# EAGLE board framMega (EAGLE 8.3.0)
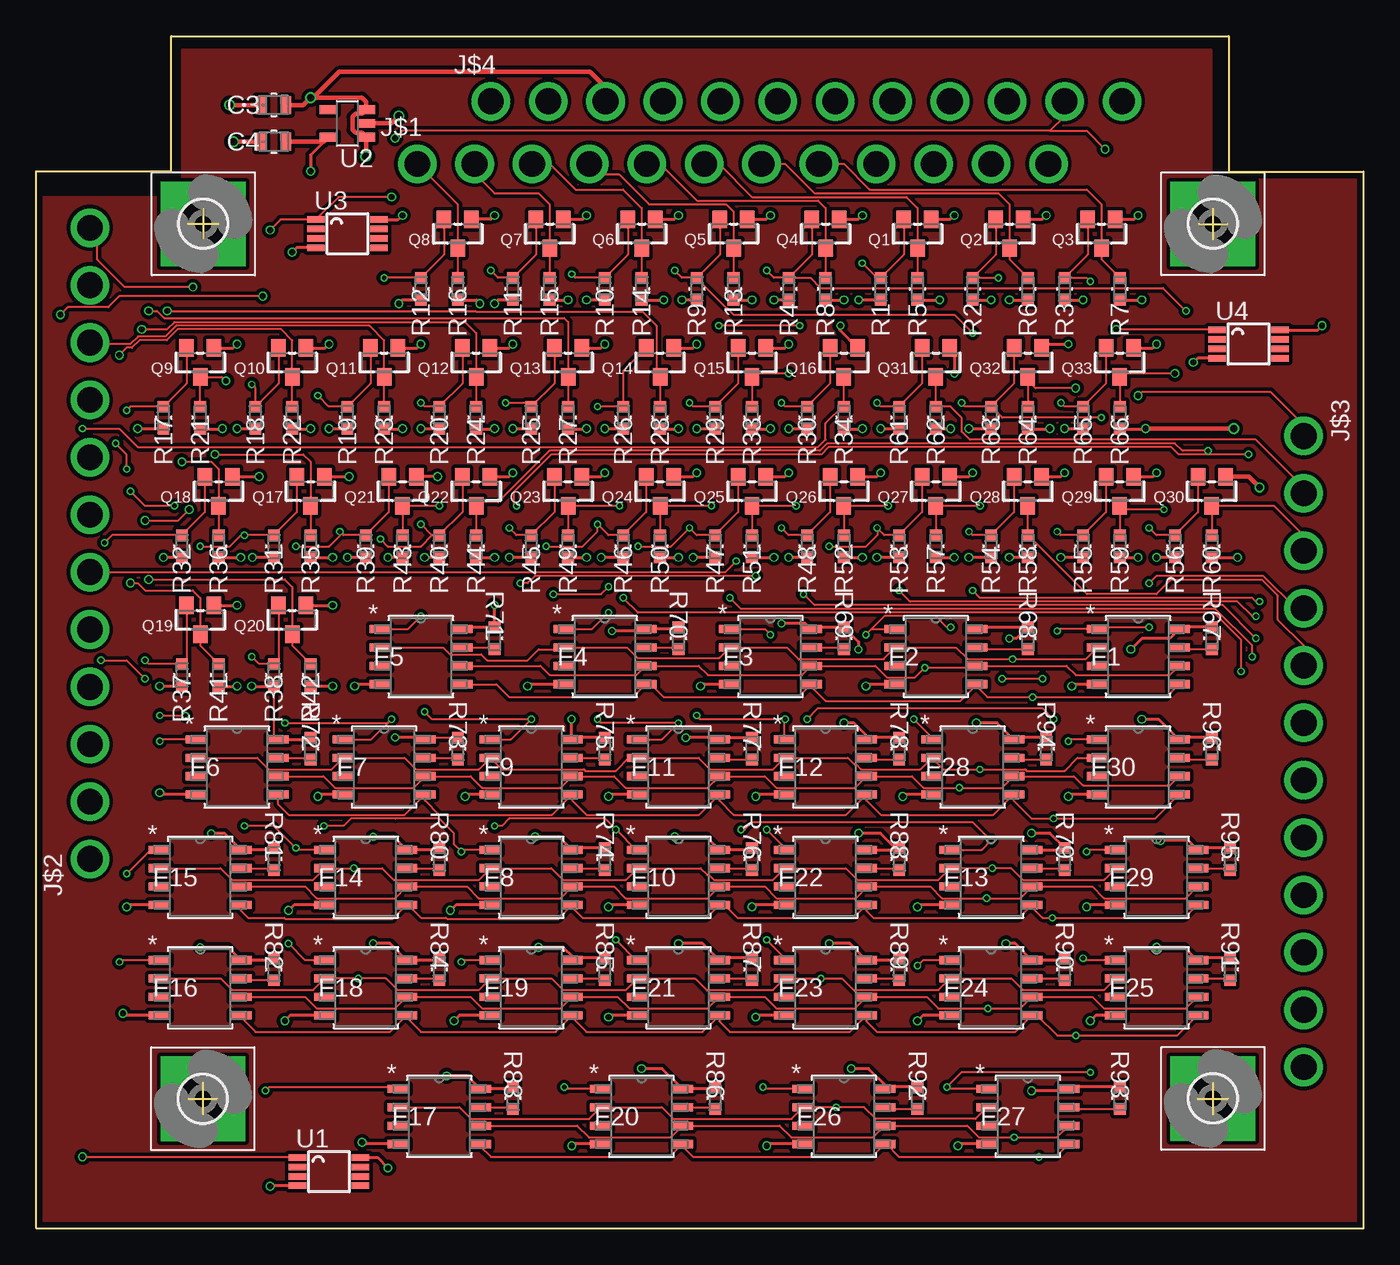
[diagram p9: board, top side]
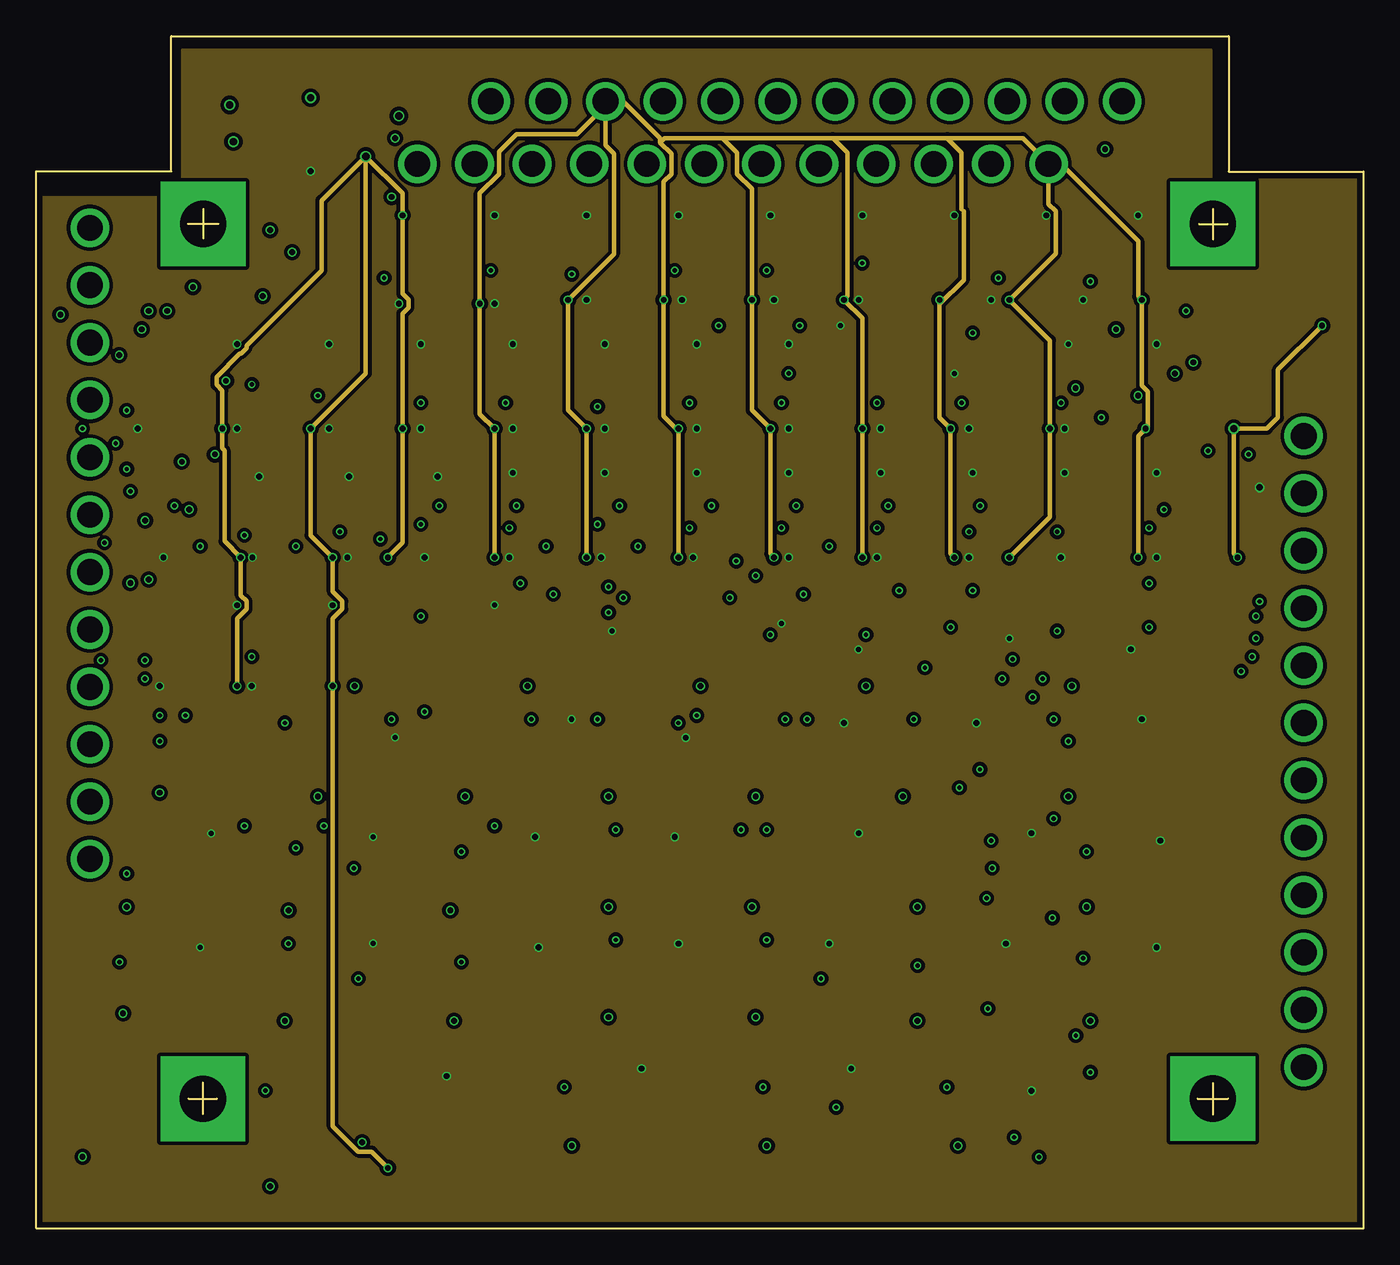
[diagram p10: board, inner layer Route2]
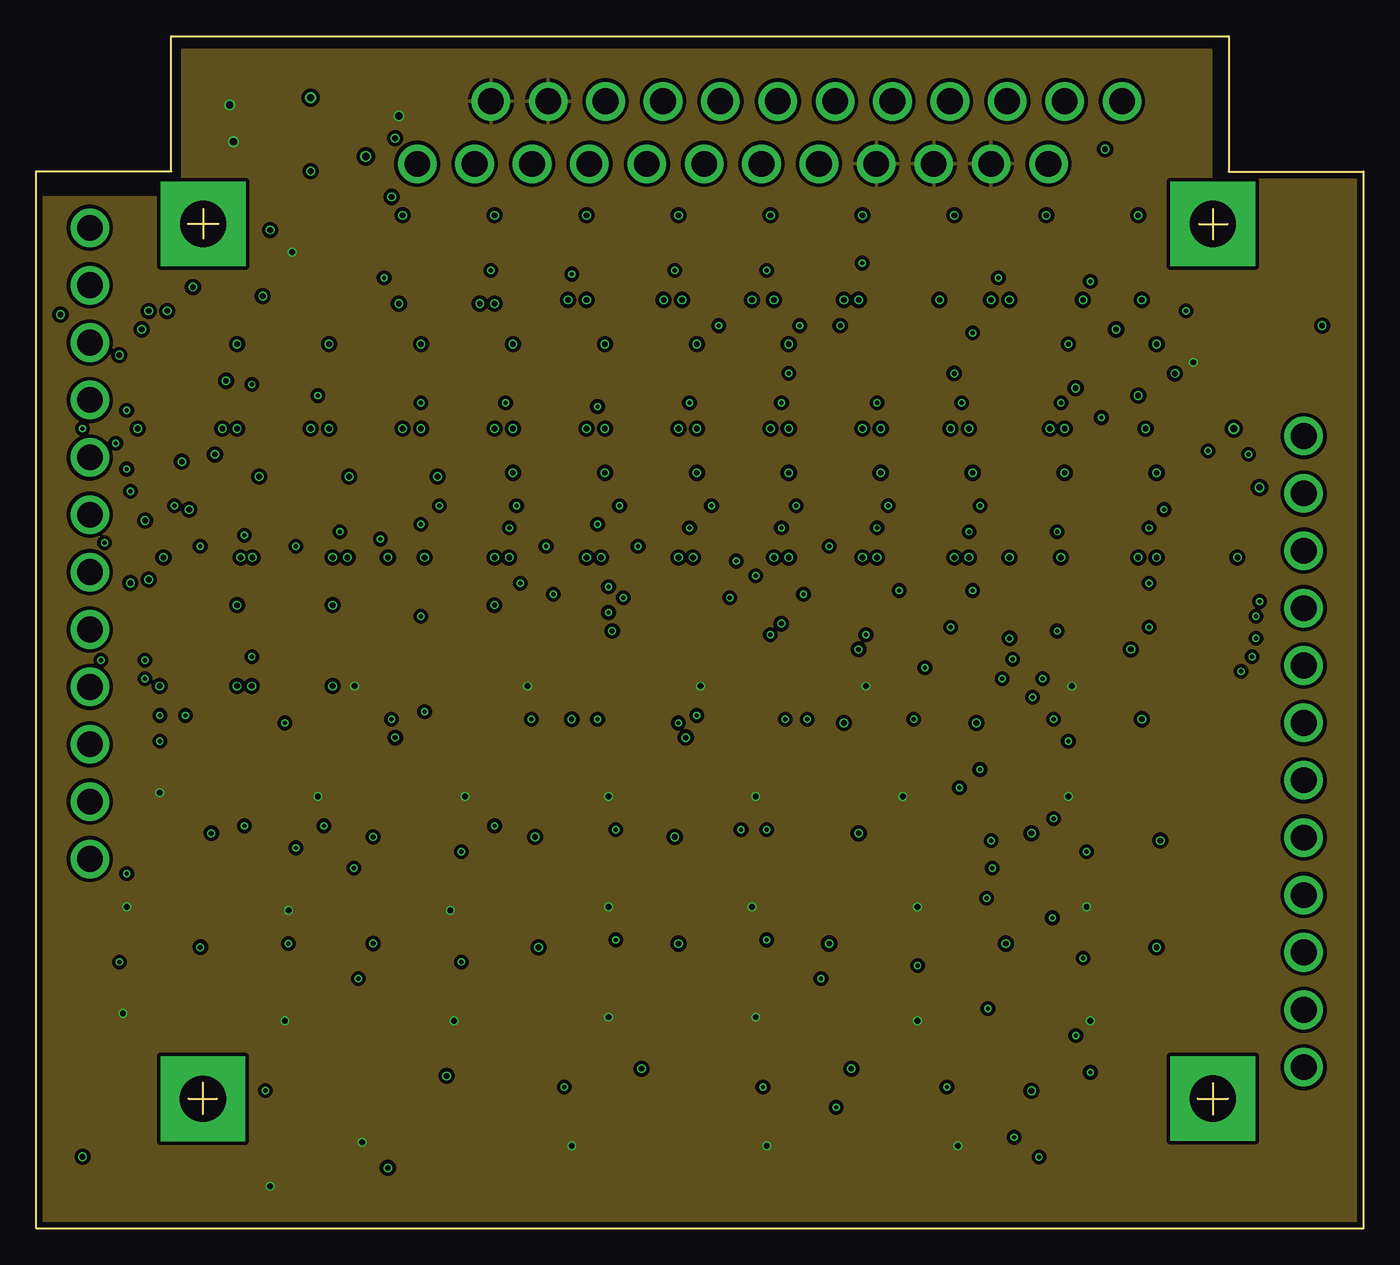
[diagram p11: board, inner layer Route15]
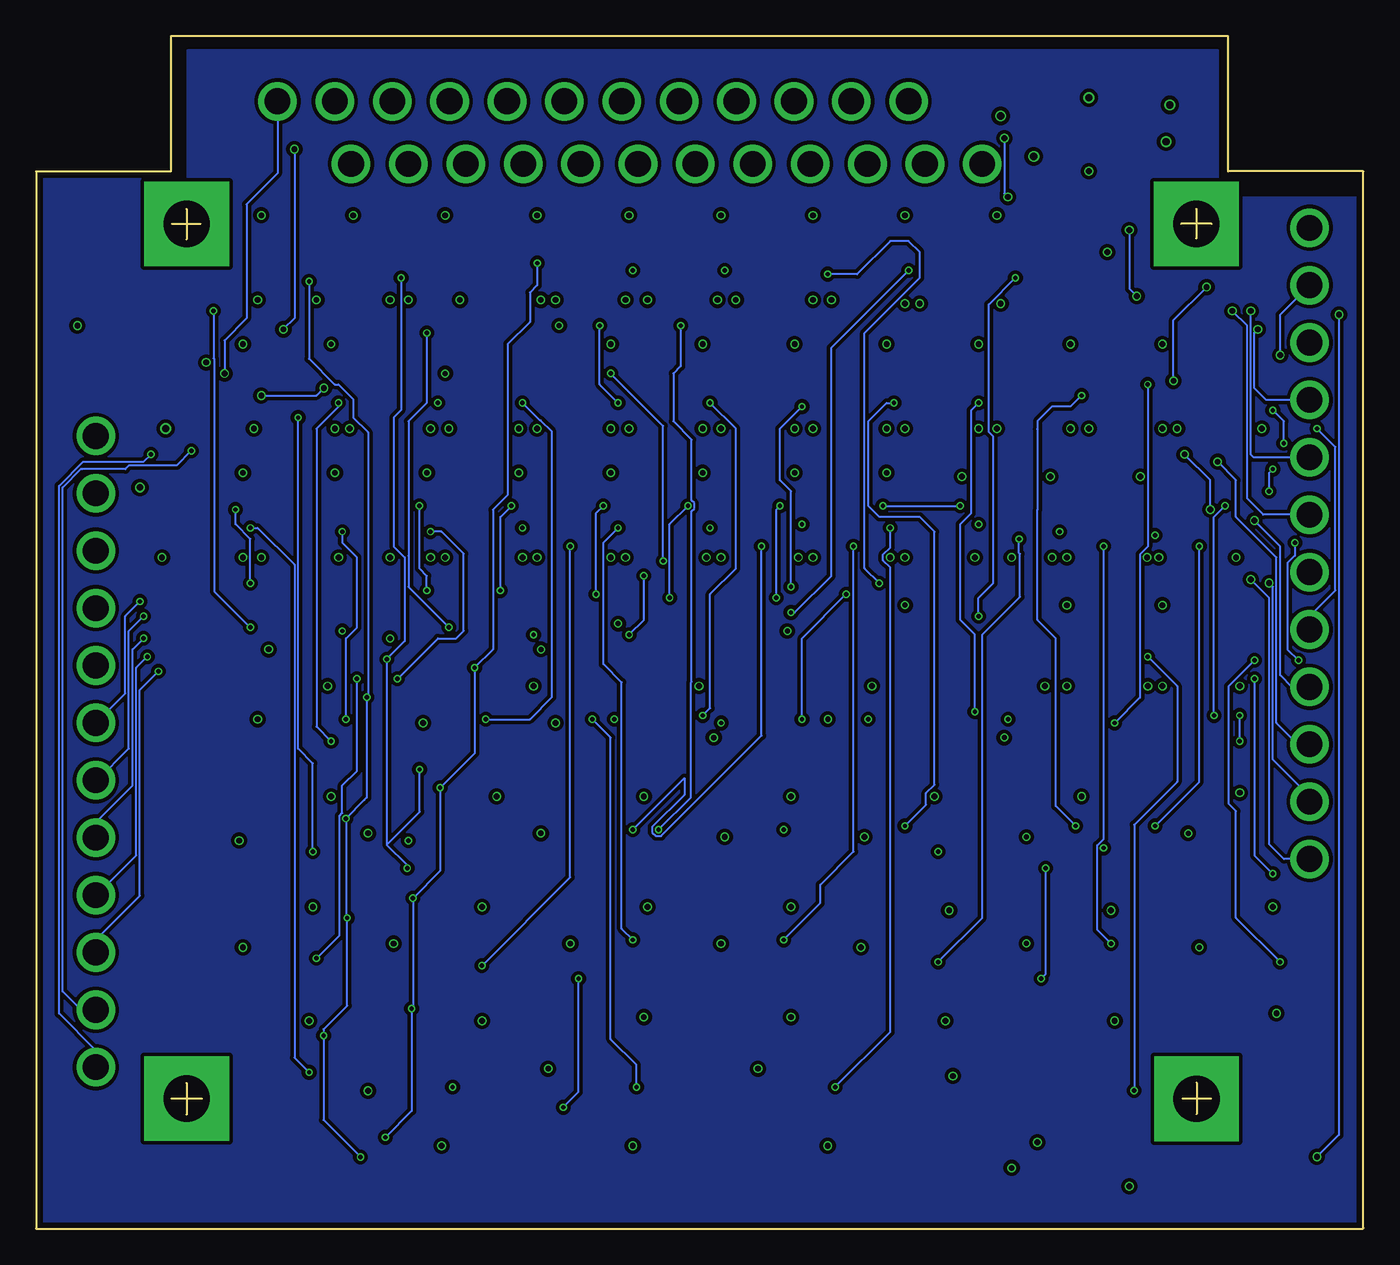
[diagram p12: board, bottom side, seen from below]

Size 91.64 x 82.35 mm. Coordinates in mm from the lower left corner, seen from the top.
Outline: 11.53,70.43 11.53,68.38
Outline: 10.49,69.39 12.6,69.39
Outline: 10.52,8.97 12.5,8.97
Outline: 11.51,10.08 11.51,7.92
Outline: 81.25,10.06 81.25,7.87
Outline: 80.19,8.97 82.3,8.97
Outline: 81.25,70.41 81.25,68.33
Outline: 80.29,69.37 82.27,69.37
Outline: 0,0.03 0,73.02 9.32,73.02 9.32,82.35 82.35,82.35 82.35,73 91.64,73 91.64,0 0.03,0 0,0.03
Copper layers (1*2*15*16): Top 0.035559375mm / dielectric 0.17018125mm / Route2 0.01778125mm / dielectric 47mil / Route15 0.01778125mm / dielectric 0.17018125mm / Bottom 0.035559375mm
Design rules "oshpark-4layer": minimum track width 5mil, minimum drill 10mil, track to track 5mil, track to pad 5mil, pad to pad 5mil, via to via 5mil, smd to smd 5mil, copper to edge 15mil, drill to drill 6mil, minimum pad ring 4mil, minimum via ring 4mil, stop-mask expansion 2.5mil, vias tented up to drill 0mil, thermal gap 10mil
Net classes: 1 power: width 0.61 mm, drill 0.406 mm, clearance 0.205 mm to class 0, clearance 0.205 mm; 2 gnd: width 0.305 mm, drill 0.406 mm, clearance 0.205 mm to class 0, clearance 0.205 mm to class 1, clearance 0.205 mm; 3 power usb: width 0.508 mm, drill 0.406 mm, clearance 0.205 mm to class 0, clearance 0.205 mm to class 1, clearance 0.205 mm to class 2, clearance 0.205 mm

## Footprints (pad centres in the part's own frame; a part is rotated, then mirrored left to right if it is on the bottom)
CAP_GRM219R61A106KE44D = smd 0.711 x 1.245: 1 -0.851,0; 2 0.851,0
FRAM_MB85RS2MTA_FPT-8P-M09 = smd 1.473 x 0.559: 1 -2.819,1.905; 2 -2.819,0.635; 3 -2.819,-0.635; 4 -2.819,-1.905; 5 2.819,-1.905; 6 2.819,-0.635; 7 2.819,0.635; 8 2.819,1.905
3,2-PAD-SQUARE = drill 3.2 pad 5.842 square: B3,2 0,0
WIREWRAPPOST = drill 1.778 pad 2.54: 1 0,0; 2 3.962,0; 3 7.925,0; 4 11.887,0; 5 15.85,0; 6 19.812,0; 7 23.774,0; 8 27.737,0; 9 31.699,0; 10 35.662,0; 11 39.624,0; 12 43.586,0
SOT23-WIDE = smd 1 x 1.2: 1 -0.95,-1; 2 0.95,-1; 3 0,1
RC0603N = smd 0.762 x 0.813: 1 -0.775,0; 2 0.775,0
SOP65P500X110-8N = smd 1.2 x 0.45: 1 -2.175,0.975; 2 -2.175,0.325; 3 -2.175,-0.325; 4 -2.175,-0.975; 5 2.175,-0.975; 6 2.175,-0.325; 7 2.175,0.325; 8 2.175,0.975
SOT23-5 = smd 0.6 x 1.2: EN 0.95,-1.306; GND 0,-1.306; IN -0.95,-1.306; NC/ADJ 0.95,1.306; OUT -0.95,1.306

## Placement (x,y rotation side)
C3  10uF  [CAP_GRM219R61A106KE44D]  16.41,77.6 0 top
C4  10uF  [CAP_GRM219R61A106KE44D]  16.41,75.06 0 top
F1  2Mb (256K x 8)  [FRAM_MB85RS2MTA_FPT-8P-M09]  76.1,39.5 0 top
F2  2Mb (256K x 8)  [FRAM_MB85RS2MTA_FPT-8P-M09]  62.13,39.5 0 top
F3  2Mb (256K x 8)  [FRAM_MB85RS2MTA_FPT-8P-M09]  50.7,39.5 0 top
F4  2Mb (256K x 8)  [FRAM_MB85RS2MTA_FPT-8P-M09]  39.27,39.5 0 top
F5  2Mb (256K x 8)  [FRAM_MB85RS2MTA_FPT-8P-M09]  26.57,39.5 0 top
F6  2Mb (256K x 8)  [FRAM_MB85RS2MTA_FPT-8P-M09]  13.87,31.88 0 top
F7  2Mb (256K x 8)  [FRAM_MB85RS2MTA_FPT-8P-M09]  24.03,31.88 0 top
F8  2Mb (256K x 8)  [FRAM_MB85RS2MTA_FPT-8P-M09]  34.19,24.26 0 top
F9  2Mb (256K x 8)  [FRAM_MB85RS2MTA_FPT-8P-M09]  34.19,31.88 0 top
F10  2Mb (256K x 8)  [FRAM_MB85RS2MTA_FPT-8P-M09]  44.35,24.26 0 top
F11  2Mb (256K x 8)  [FRAM_MB85RS2MTA_FPT-8P-M09]  44.35,31.88 0 top
F12  2Mb (256K x 8)  [FRAM_MB85RS2MTA_FPT-8P-M09]  54.51,31.88 0 top
F13  2Mb (256K x 8)  [FRAM_MB85RS2MTA_FPT-8P-M09]  65.94,24.26 0 top
F14  2Mb (256K x 8)  [FRAM_MB85RS2MTA_FPT-8P-M09]  22.76,24.26 0 top
F15  2Mb (256K x 8)  [FRAM_MB85RS2MTA_FPT-8P-M09]  11.33,24.26 0 top
F16  2Mb (256K x 8)  [FRAM_MB85RS2MTA_FPT-8P-M09]  11.33,16.64 0 top
F17  2Mb (256K x 8)  [FRAM_MB85RS2MTA_FPT-8P-M09]  27.84,7.75 0 top
F18  2Mb (256K x 8)  [FRAM_MB85RS2MTA_FPT-8P-M09]  22.76,16.64 0 top
F19  2Mb (256K x 8)  [FRAM_MB85RS2MTA_FPT-8P-M09]  34.19,16.64 0 top
F20  2Mb (256K x 8)  [FRAM_MB85RS2MTA_FPT-8P-M09]  41.81,7.75 0 top
F21  2Mb (256K x 8)  [FRAM_MB85RS2MTA_FPT-8P-M09]  44.35,16.64 0 top
F22  2Mb (256K x 8)  [FRAM_MB85RS2MTA_FPT-8P-M09]  54.51,24.26 0 top
F23  2Mb (256K x 8)  [FRAM_MB85RS2MTA_FPT-8P-M09]  54.51,16.64 0 top
F24  2Mb (256K x 8)  [FRAM_MB85RS2MTA_FPT-8P-M09]  65.94,16.64 0 top
F25  2Mb (256K x 8)  [FRAM_MB85RS2MTA_FPT-8P-M09]  77.37,16.64 0 top
F26  2Mb (256K x 8)  [FRAM_MB85RS2MTA_FPT-8P-M09]  55.78,7.75 0 top
F27  2Mb (256K x 8)  [FRAM_MB85RS2MTA_FPT-8P-M09]  68.48,7.75 0 top
F28  2Mb (256K x 8)  [FRAM_MB85RS2MTA_FPT-8P-M09]  64.67,31.88 0 top
F29  2Mb (256K x 8)  [FRAM_MB85RS2MTA_FPT-8P-M09]  77.37,24.26 0 top
F30  2Mb (256K x 8)  [FRAM_MB85RS2MTA_FPT-8P-M09]  76.1,31.88 0 top
H1  MOUNT-PAD-SQUARE3.2  [3,2-PAD-SQUARE]  81.25,69.39 0 top
H2  MOUNT-PAD-SQUARE3.2  [3,2-PAD-SQUARE]  11.53,69.39 0 top
H3  MOUNT-PAD-SQUARE3.2  [3,2-PAD-SQUARE]  81.25,8.99 0 top
H4  MOUNT-PAD-SQUARE3.2  [3,2-PAD-SQUARE]  11.51,8.97 0 top
J$1  FRAM_A  [WIREWRAPPOST]  26.31,73.53 0 top
J$2  FRAM_A  [WIREWRAPPOST]  3.71,25.53 90 top
J$3  FRAM_A  [WIREWRAPPOST]  87.53,54.74 270 top
J$4  FRAM_A  [WIREWRAPPOST]  31.39,77.85 0 top
Q1  BSS138  [SOT23-WIDE]  60.86,68.71 180 top
Q2  BSS138  [SOT23-WIDE]  67.21,68.71 180 top
Q3  BSS138  [SOT23-WIDE]  73.56,68.71 180 top
Q4  BSS138  [SOT23-WIDE]  54.51,68.71 180 top
Q5  BSS138  [SOT23-WIDE]  48.16,68.71 180 top
Q6  BSS138  [SOT23-WIDE]  41.81,68.71 180 top
Q7  BSS138  [SOT23-WIDE]  35.46,68.71 180 top
Q8  BSS138  [SOT23-WIDE]  29.11,68.71 180 top
Q9  BSS138  [SOT23-WIDE]  11.33,59.82 180 top
Q10  BSS138  [SOT23-WIDE]  17.68,59.82 180 top
Q11  BSS138  [SOT23-WIDE]  24.03,59.82 180 top
Q12  BSS138  [SOT23-WIDE]  30.38,59.82 180 top
Q13  BSS138  [SOT23-WIDE]  36.73,59.82 180 top
Q14  BSS138  [SOT23-WIDE]  43.08,59.82 180 top
Q15  BSS138  [SOT23-WIDE]  49.43,59.82 180 top
Q16  BSS138  [SOT23-WIDE]  55.78,59.82 180 top
Q17  BSS138  [SOT23-WIDE]  18.95,50.93 180 top
Q18  BSS138  [SOT23-WIDE]  12.6,50.93 180 top
Q19  BSS138  [SOT23-WIDE]  11.33,42.04 180 top
Q20  BSS138  [SOT23-WIDE]  17.68,42.04 180 top
Q21  BSS138  [SOT23-WIDE]  25.3,50.93 180 top
Q22  BSS138  [SOT23-WIDE]  30.38,50.93 180 top
Q23  BSS138  [SOT23-WIDE]  36.73,50.93 180 top
Q24  BSS138  [SOT23-WIDE]  43.08,50.93 180 top
Q25  BSS138  [SOT23-WIDE]  49.43,50.93 180 top
Q26  BSS138  [SOT23-WIDE]  55.78,50.93 180 top
Q27  BSS138  [SOT23-WIDE]  62.13,50.93 180 top
Q28  BSS138  [SOT23-WIDE]  68.48,50.93 180 top
Q29  BSS138  [SOT23-WIDE]  74.83,50.93 180 top
Q30  BSS138  [SOT23-WIDE]  81.18,50.93 180 top
Q31  BSS138  [SOT23-WIDE]  62.13,59.82 180 top
Q32  BSS138  [SOT23-WIDE]  68.48,59.82 180 top
Q33  BSS138  [SOT23-WIDE]  74.83,59.82 180 top
R1  10K  [RC0603N]  58.32,64.9 90 top
R2  10K  [RC0603N]  64.67,64.9 90 top
R3  10K  [RC0603N]  71.02,64.9 90 top
R4  10K  [RC0603N]  51.97,64.9 90 top
R5  10K  [RC0603N]  60.86,64.9 90 top
R6  10K  [RC0603N]  68.48,64.9 90 top
R7  10K  [RC0603N]  74.83,64.9 90 top
R8  10K  [RC0603N]  54.51,64.9 90 top
R9  10K  [RC0603N]  45.62,64.9 90 top
R10  10K  [RC0603N]  39.27,64.9 90 top
R11  10K  [RC0603N]  32.92,64.9 90 top
R12  10K  [RC0603N]  26.57,64.9 90 top
R13  10K  [RC0603N]  48.16,64.9 90 top
R14  10K  [RC0603N]  41.81,64.9 90 top
R15  10K  [RC0603N]  35.46,64.9 90 top
R16  10K  [RC0603N]  29.11,64.9 90 top
R17  10K  [RC0603N]  8.79,56.01 90 top
R18  10K  [RC0603N]  15.14,56.01 90 top
R19  10K  [RC0603N]  21.49,56.01 90 top
R20  10K  [RC0603N]  27.84,56.01 90 top
R21  10K  [RC0603N]  11.33,56.01 90 top
R22  10K  [RC0603N]  17.68,56.01 90 top
R23  10K  [RC0603N]  24.03,56.01 90 top
R24  10K  [RC0603N]  30.38,56.01 90 top
R25  10K  [RC0603N]  34.19,56.01 90 top
R26  10K  [RC0603N]  40.54,56.01 90 top
R27  10K  [RC0603N]  36.73,56.01 90 top
R28  10K  [RC0603N]  43.08,56.01 90 top
R29  10K  [RC0603N]  46.89,56.01 90 top
R30  10K  [RC0603N]  53.24,56.01 90 top
R31  10K  [RC0603N]  16.41,47.12 90 top
R32  10K  [RC0603N]  10.06,47.12 90 top
R33  10K  [RC0603N]  49.43,56.01 90 top
R34  10K  [RC0603N]  55.78,56.01 90 top
R35  10K  [RC0603N]  18.95,47.12 90 top
R36  10K  [RC0603N]  12.6,47.12 90 top
R37  10K  [RC0603N]  10.06,38.23 90 top
R38  10K  [RC0603N]  16.41,38.23 90 top
R39  10K  [RC0603N]  22.76,47.12 90 top
R40  10K  [RC0603N]  27.84,47.12 90 top
R41  10K  [RC0603N]  12.6,38.23 90 top
R42  10K  [RC0603N]  18.95,38.23 90 top
R43  10K  [RC0603N]  25.3,47.12 90 top
R44  10K  [RC0603N]  30.38,47.12 90 top
R45  10K  [RC0603N]  34.19,47.12 90 top
R46  10K  [RC0603N]  40.54,47.12 90 top
R47  10K  [RC0603N]  46.89,47.12 90 top
R48  10K  [RC0603N]  53.24,47.12 90 top
R49  10K  [RC0603N]  36.73,47.12 90 top
R50  10K  [RC0603N]  43.08,47.12 90 top
R51  10K  [RC0603N]  49.43,47.12 90 top
R52  10K  [RC0603N]  55.78,47.12 90 top
R53  10K  [RC0603N]  59.59,47.12 90 top
R54  10K  [RC0603N]  65.94,47.12 90 top
R55  10K  [RC0603N]  72.29,47.12 90 top
R56  10K  [RC0603N]  78.64,47.12 90 top
R57  10K  [RC0603N]  62.13,47.12 90 top
R58  10K  [RC0603N]  68.48,47.12 90 top
R59  10K  [RC0603N]  74.83,47.12 90 top
R60  10K  [RC0603N]  81.18,47.12 90 top
R61  10K  [RC0603N]  59.59,56.01 90 top
R62  10K  [RC0603N]  62.13,56.01 90 top
R63  10K  [RC0603N]  65.94,56.01 90 top
R64  10K  [RC0603N]  68.48,56.01 90 top
R65  10K  [RC0603N]  72.29,56.01 90 top
R66  10K  [RC0603N]  74.83,56.01 90 top
R67  10K  [RC0603N]  81.18,40.77 270 top
R68  10K  [RC0603N]  68.48,40.77 270 top
R69  10K  [RC0603N]  55.78,40.77 270 top
R70  10K  [RC0603N]  44.35,40.77 270 top
R71  10K  [RC0603N]  31.65,40.77 270 top
R72  10K  [RC0603N]  18.95,33.15 270 top
R73  10K  [RC0603N]  29.11,33.15 270 top
R74  10K  [RC0603N]  39.27,25.53 270 top
R75  10K  [RC0603N]  39.27,33.15 270 top
R76  10K  [RC0603N]  49.43,25.53 270 top
R77  10K  [RC0603N]  49.43,33.15 270 top
R78  10K  [RC0603N]  59.59,33.15 270 top
R79  10K  [RC0603N]  71.02,25.53 270 top
R80  10K  [RC0603N]  27.84,25.53 270 top
R81  10K  [RC0603N]  16.41,25.53 270 top
R82  10K  [RC0603N]  16.41,17.91 270 top
R83  10K  [RC0603N]  32.92,9.02 270 top
R84  10K  [RC0603N]  27.84,17.91 270 top
R85  10K  [RC0603N]  39.27,17.91 270 top
R86  10K  [RC0603N]  46.89,9.02 270 top
R87  10K  [RC0603N]  49.43,17.91 270 top
R88  10K  [RC0603N]  59.59,25.53 270 top
R89  10K  [RC0603N]  59.59,17.91 270 top
R90  10K  [RC0603N]  71.02,17.91 270 top
R91  10K  [RC0603N]  82.45,17.91 270 top
R92  10K  [RC0603N]  60.86,9.02 270 top
R93  10K  [RC0603N]  74.83,9.02 270 top
R94  10K  [RC0603N]  69.75,33.15 270 top
R95  10K  [RC0603N]  82.45,25.53 270 top
R96  10K  [RC0603N]  81.18,33.15 270 top
U1  DS18B20U+T&R  [SOP65P500X110-8N]  20.22,3.94 0 top
U2  MIC5225  [SOT23-5]  21.49,76.33 90 top
U3  DS18B20U+T&R  [SOP65P500X110-8N]  21.49,68.71 0 top
U4  DS18B20U+T&R  [SOP65P500X110-8N]  83.72,61.09 0 top

## Tracks (layer width: path | path; a pad name or v marks a point on that pad's centre or on a via)
3.3V  (via drill 0.35, 0.4, 0.45)
  Top 0.127: R73.1 26.99,33.92 F7.8 | R38.1 16.41,34.06 F6.8
  Top 0.203: Q8.1 31.38,69.71 v31.65,69.98 | Q7.1 37.73,69.71 v38,69.98 | Q6.1 44.08,69.71 v44.35,69.98 | Q5.1 50.43,69.71 v50.7,69.98 | Q15.1 51.7,60.82 v51.97,61.09 | Q14.1 45.35,60.82 v45.62,61.09 | Q13.1 39,60.82 v39.27,61.09 | Q12.1 32.65,60.82 v32.92,61.09 | Q11.1 26.3,60.82 v26.57,61.09 | Q10.1 19.95,60.82 v20.22,61.09 | Q9.1 13.6,60.82 v13.87,61.09 | Q4.1 56.78,69.71 v57.05,69.98 | Q1.1 63.13,69.71 v63.4,69.98 | Q2.1 69.48,69.71 v69.75,69.98 | Q3.1 75.83,69.71 v76.1,69.98 | Q33.1 77.1,60.82 v77.37,61.09 | Q29.1 77.1,51.93 v77.37,52.2 | Q28.1 70.75,51.93 v71.02,52.2 | Q27.1 64.4,51.93 v64.67,52.2 | Q26.1 58.05,51.93 v58.32,52.2 | Q25.1 51.7,51.93 v51.97,52.2 | Q24.1 45.35,51.93 v45.62,52.2 | Q23.1 39,51.93 v39.27,52.2 | Q22.1 32.65,51.93 v32.92,52.2 | Q21.1 27.7,51.93 v27.71,51.94 | Q17.1 21.6,51.93 v21.62,51.94 | Q18.1 15.38,51.93 v15.39,51.94 | Q19.1 13.85,43.04 v13.87,43.05 | Q20.1 20.46,43.04 v20.47,43.05 | R37.1 8.55,37.45 v8.53,37.47 | R38.1 14.9,37.45 v14.88,37.47 | R32.1 8.8,46.34 v8.79,46.36 | R31.1 14.94,46.34 v14.93,46.36 | R39.1 21.5,46.34 v21.49,46.36 | R40.1 26.84,46.34 v26.82,46.36 | R45.1 32.68,46.34 v32.66,46.36 | R46.1 39.03,46.34 v39.01,46.36 | R47.1 45.38,46.34 v45.36,46.36 | R48.1 51.98,46.34 v51.97,46.36 | R53.1 58.08,46.34 v58.06,46.36 | R54.1 64.43,46.34 v64.41,46.36 | R55.1 70.78,46.34 v70.76,46.36 | R56.1 77.38,46.34 v77.37,46.36 | R83.1 32.78,9.65 F17.8 29.77,10.54 v28.35,10.54 | R86.1 46.75,9.65 F20.8 43.23,11.05 v41.81,11.05 | R92.1 58.74,9.79 | 58.74,9.79 F26.8 | R93.1 71.44,9.79 | 71.44,9.79 F27.8 | R91.1 80.33,18.68 F25.8 79.3,19.43 v77.37,19.43 | R90.1 70.88,18.54 F24.8 67.61,19.68 v66.95,19.68 | R87.1 47.31,18.68 F21.8 46.02,19.68 v44.35,19.68
  Top 0.203: R89.1 59.45,18.54 F23.8 56.18,19.68 v54.76,19.68 | R85.1 37.15,18.68 | 37.15,18.68 F19.8 | R81.1 16.27,26.16 F15.8 13,27.3 v12.09,27.3 | R82.1 16.27,18.54 F16.8 13.26,19.43 v11.33,19.43 | R84.1 27.7,18.54 F18.8 24.43,19.68 v23.27,19.68 | R80.1 27.7,26.16 F14.8 24.69,27.05 v23.27,27.05 | R74.1 37.15,26.3 F8.8 36.12,27.05 v34.44,27.05 | R76.1 49.29,26.16 F10.8 46.28,27.05 v44.09,27.05 | F22.8 59.45,26.16 | 59.45,26.16 R88.1 | F13.8 70.88,26.16 R79.1 70.02,27.3 v68.73,27.3 | R95.1 80.33,26.3 F29.8 79.55,26.8 v77.62,26.8 | F6.8 18.81,33.78 R72.1 | F5.8 29.53,41.54 R71.1 v31.65,43.05 | R70.1 44.21,41.4 F4.8 41.96,41.28 v39.78,41.28 | R77.1 47.31,33.92 F11.8 47.04,33.91 v44.86,33.91 | R75.1 37.15,33.92 F9.8 36.98,33.81 v36.98,35.18 | F2.8 65.09,41.54 R68.1 67.7,40.77 v67.21,40.77 | R94.1 67.63,33.92 F28.8 66.34,34.93 v64.92,34.93 | R78.1 57.47,33.92 | 57.47,33.92 F12.8 | R96.1 79.06,33.92 F30.8 77.52,35.18 v76.35,35.18 | R67.1 79.06,41.54 | 79.06,41.54 F1.8 | R12.1 25.29,64.12 v25.04,63.88 | R11.1 31.89,64.12 v31.65,63.88 | R10.1 38.01,64.12 v38,64.13 | R9.1 44.62,64.12 v44.6,64.13 | R4.1 50.97,64.12 v50.95,64.13 | R1.1 56.81,64.12 v56.79,64.13 | R2.1 65.93,64.12 v65.94,64.13 | R3.1 72.28,64.12 v72.29,64.13 | R65.1 71.03,55.23 v71.02,55.25 | R63.1 64.43,55.23 v64.41,55.25 | R61.1 58.33,55.23 v58.32,55.25 | R17.1 7.02,55.23 v7.01,55.25 | R18.1 13.88,55.23 v13.87,55.25 | R19.1 20.23,55.23 v20.22,55.25 | R20.1 26.58,55.23 v26.57,55.25 | R25.1 32.93,55.23 v32.92,55.25 | R26.1 39.28,55.23 v39.27,55.25 | R29.1 45.63,55.23 v45.62,55.25 | R30.1 51.98,55.23 v51.97,55.25 | Q16.1 55.52,62.02 v55.52,62.36 | Q31.1 63.4,60.5 v63.4,59.05
  Top 0.203: Q32.1 69.7,61.09 v71.27,61.09 | v51.46,41.78 53.14,41.78 F3.8 53.66,41.54 R69.1 56.79,40.53 v56.79,40.01 | F7.8 26.72,33.91 v24.79,33.91 | 37.15,18.68 36.4,19.43 v34.7,19.43 | 58.74,9.79 57.48,11.05 v56.29,11.05 | 59.45,26.16 58.31,27.3 v56.79,27.3 | 71.44,9.79 71.17,9.53 v68.73,9.53 | 57.47,33.92 56.46,34.93 v55.78,34.93 | 79.06,41.54 78.28,40.77 76.35,40.77 v75.59,40.01 | U2.OUT 18.95,74.14 v18.95,73.02
  Top 0.305: C4.2 19.86,75.06 U2.OUT | Q30.1 83.73,51.93 v84.48,51.18
  Route2 0.203: v14.93,46.36 14.73,46.36
  pour Route2 (isolate 0.254): -0.1,0.13 91.34,0.13 91.34,72.52 81.18,72.52 81.18,81.41 10.06,81.41 10.06,71.25 -0.1,71.25
5V  (via drill 0.4, 0.5)
  Top 0.203: U3.8 25,69.68 v25.3,69.98 | U4.8 88.5,62.06 v88.8,62.36 | R41.1 13.86,37.45 v13.87,37.47 | R42.1 20.46,37.45 v20.47,37.47 | R36.1 14.11,46.34 v14.12,46.36 | R35.1 20.46,46.34 v20.47,46.36 | R43.1 24.3,46.34 v24.28,46.36 | R44.1 31.64,46.34 v31.65,46.36 | R49.1 37.99,46.34 v38,46.36 | R50.1 44.34,46.34 v44.35,46.36 | R51.1 50.94,46.34 v50.95,46.36 | R52.1 57.04,46.34 v57.05,46.36 | R57.1 63.39,46.34 v63.4,46.36 | R58.1 67.22,46.34 v67.21,46.36 | R59.1 76.09,46.34 v76.1,46.36 | R60.1 82.94,46.34 v82.96,46.36 | U1.8 23.56,4.91 v24.28,4.19 | R16.1 30.39,64.12 v30.63,63.88 | R15.1 36.72,64.12 v36.73,64.13 | R14.1 43.32,64.12 v43.33,64.13 | R13.1 49.42,64.12 v49.43,64.13 | R8.1 55.77,64.12 v55.78,64.13 | R5.1 62.37,64.12 v62.38,64.13 | R6.1 67.22,64.12 v67.21,64.13 | R7.1 76.34,64.12 v76.35,64.13 | R66.1 76.59,55.23 v76.61,55.25 | R64.1 69.99,55.23 v70,55.25 | R62.1 63.13,55.23 v63.14,55.25 | R34.1 57.04,55.23 v57.05,55.25 | R21.1 12.84,55.23 v12.85,55.25 | R22.1 18.94,55.23 v18.95,55.25 | R23.1 25.29,55.23 v25.3,55.25 | R24.1 31.64,55.23 v31.65,55.25 | R27.1 37.99,55.23 v38,55.25 | R28.1 44.34,55.23 v44.35,55.25 | R33.1 50.69,55.23 v50.7,55.25
  Top 0.305: C3.2 18.44,77.6 v18.95,78.1 19.14,78.1 | 19.14,78.1 22.5,78.1 22.79,77.81 U2.EN 22.5,76.98 22.05,76.98 21.84,76.77 21.84,75.88 22.05,75.67 22.5,75.67 U2.IN 22.79,74.08 v22.76,74.04 | v76.61,55.25 v82.7,55.25 | J$4.3 39.32,78.82 38.25,79.88 20.91,79.88 19.14,78.1
  Route2 0.305: v22.76,74.04 25.3,71.5 v25.3,69.98 25.3,64.56 25.7,64.15 25.7,63.61 25.3,63.2 v25.3,55.25 25.3,47.37 v24.28,46.36 | v31.65,46.36 v31.65,55.25 30.63,56.26 v30.63,63.88 30.63,71.5 31.97,72.83 31.97,74.36 33.17,75.56 37.34,75.56 39.32,77.54 | v38,46.36 v38,55.25 36.73,56.52 v36.73,64.13 39.89,67.3 39.89,74.23 39.32,74.81 39.32,77.54 | 44.35,55.09 v44.35,46.36 | 44.35,55.09 v44.35,55.25 | v50.95,46.36 50.7,46.61 v50.7,55.25 49.43,56.52 v49.43,64.13 49.43,71.8 48.4,72.83 48.4,74.31 47.4,75.31 | v57.05,46.36 v57.05,55.25 57.05,62.87 v55.78,64.13 56.03,64.39 56.03,74.3 55.02,75.31 | v63.4,46.36 63.14,46.61 v63.14,55.25 62.38,56.01 62.38,63.83 | v67.21,46.36 70,49.15 v70,55.25 70,61.34 v67.21,64.13 70.41,67.33 70.41,70.25 69.9,70.76 J$1.12 | v76.1,46.36 76.1,54.74 76.27,54.91 | 76.27,54.91 v76.61,55.25 | v82.96,46.36 82.7,46.61 v82.7,55.25 84.99,55.25 85.75,56.01 85.75,59.31 v88.8,62.36 | 76.27,54.91 76.76,55.4 76.76,57.8 76.35,58.21 v76.35,64.13 76.1,64.39 76.1,68.2 70.76,73.53 J$1.12 | 62.38,63.83 v62.38,64.13 | 44.35,55.09 43.33,56.11 v43.33,64.13 43.33,72.31 43.85,72.83 43.85,74.23 43.08,75.01 | v22.76,74.04 22.76,59.05 v18.95,55.25 18.95,47.88 v20.47,46.36 20.47,43.98 21.13,43.33 21.13,42.78 20.47,42.12 v20.47,37.47 20.47,7.07 22.23,5.31 23.16,5.31 v24.28,4.19 | 39.32,77.54 J$4.3 40.54,77.85 43.08,75.31 43.08,75.01 | 47.4,75.31 43.38,75.31 43.08,75.01 | 47.4,75.31 55.02,75.31 | 55.02,75.31 62.89,75.31 | 62.89,75.31 63.91,74.3 63.91,70.4 64.06,70.25 64.06,65.5 62.38,63.83 | 62.89,75.31 68.12,75.31 J$1.12 | v22.76,74.04 19.71,70.99 19.71,66.17 14.53,60.98 14.53,60.81 14.14,60.43 14.06,60.43 12.45,58.82 12.45,58.27 12.85,57.87 v12.85,55.25 12.85,53.89 13,53.74 13,47.47 v14.12,46.36 14.12,43.73 14.53,43.33 14.53,42.78 13.87,42.12 v13.87,37.47
CS1
  Top 0.127: 54.51,67.51 Q4.3 | 54.51,67.51 R8.2 | J$1.5 43.08,73.53 45.62,70.99 54,70.99 54.51,70.48 54.51,67.51
CS1_3V  (via drill 0.3)
  Top 0.127: Q4.2 53.56,67.26 R4.2 | R4.2 50.94,65.67 v50.44,66.17 | 73.2,41.4 F1.1 | 73.2,41.4 70.64,41.4 v70.51,41.28 | R4.2 53.45,65.67 54.16,64.96 77.81,64.96 v79.4,63.37 | v76.86,41.53 73.33,41.53 73.2,41.4
  Bottom 0.127: v79.4,63.37 79.4,60.12 79.34,60.05 79.34,44.01 v76.86,41.53
CS2
  Top 0.127: R13.2 Q5.3 48.16,70.23 47.65,70.74 42.32,70.74 40.28,72.77 38.96,72.77 J$1.4 38.25,73.53
CS2_3V  (via drill 0.3)
  Top 0.127: Q5.2 47.21,67.26 R9.2 | R9.2 44.59,65.67 v44.09,66.17 | 57.68,41.4 F2.1 | 57.68,41.4 v57.3,41.02 | R9.2 45.62,65.6 47.67,63.55 47.73,63.55 48.16,63.12 63.4,63.12 v64.67,61.85 | v63.14,41.53 62.89,41.53 62.13,42.29 58.57,42.29 57.68,41.4
  Bottom 0.127: v64.67,61.85 64.67,57.02 65.94,55.75 65.94,46.46 | 65.94,46.46 | 65.94,46.46 65.94,44.32 v63.14,41.53
CS3
  Top 0.127: 41.81,67.6 Q6.3 | 41.81,67.6 R14.2 | J$1.3 35.46,73.53 37.24,71.75 40.54,71.75 41.81,70.48 41.81,67.6
CS3_3V  (via drill 0.3)
  Top 0.127: Q6.2 40.86,67.26 R10.2 37.22,65.67 v36.98,65.91 | F3.1 50.32,41.4 v50.7,41.02 | v49.68,45.09 34.44,45.09 33.93,44.58 v33.43,44.58
  Bottom 0.127: v50.7,41.02 49.68,42.04 v49.68,45.09 | v33.43,44.58 34.44,45.59 34.44,61.85 30.63,65.66 30.63,67.44 31.39,68.2 32.66,68.2 34.95,65.91 v36.98,65.91
CS4
  Top 0.127: R15.2 Q7.3 35.46,70.74 34.7,71.5 31.65,71.5 30.28,72.87 J$1.2
CS4_3V  (via drill 0.3)
  Top 0.127: Q7.2 34.51,67.26 R11.2 31.89,65.67 v31.39,66.17 | F4.1 38.38,41.4 v39.52,42.55
  Bottom 0.127: v39.52,42.55 39.27,42.55 36.73,45.09 36.73,60.83 v31.39,66.17
CS5
  Top 0.127: 29.11,67.69 Q8.3 | 29.11,67.69 R16.2 | J$1.1 29.11,70.74 29.11,67.69
CS5_3V  (via drill 0.3)
  Top 0.127: Q8.2 28.16,67.26 R12.2 24.04,65.67 v24.03,65.66 | F5.1 25.68,41.4 v26.57,42.29
  Bottom 0.127: v26.57,42.29 26.57,43.56 25.55,44.58 25.55,54.69 25.87,55.01 25.87,63.82 v24.03,65.66
CS6  (via drill 0.4)
  Top 0.127: R21.2 Q9.3 12.84,58.82 v13.11,58.55 | v10.82,65.03 6.12,65.03 4.22,66.93 4.22,68.6 J$2.12
  Bottom 0.127: v13.11,58.55 13.11,62.74 v10.82,65.03
CS6_3V  (via drill 0.3)
  Top 0.127: Q9.2 10.38,58.37 R17.2 6.52,56.78 v6.25,56.52 | F6.1 8.66,33.78 v8.53,33.66 | v8.53,35.43 v10.31,35.43 | v9.55,49.91 7.52,49.91 v6.5,50.93 | v6.25,52.45 6.25,53.47 v5.49,54.23
  Bottom 0.127: v8.53,33.66 v8.53,35.43 | v10.31,35.43 10.31,49.15 v9.55,49.91 | v6.5,50.93 6.5,52.2 v6.25,52.45 | v5.49,54.23 5.49,55.75 v6.25,56.52
CS7  (via drill 0.4)
  Top 0.127: R22.2 Q10.3 17.68,61.34 16.92,62.1 9.76,62.1 9.01,61.36 7.13,61.36 6.61,60.83 6.25,60.83 v5.74,60.33
  Bottom 0.127: v5.74,60.33 5.74,63.12 J$2.11
CS7_3V  (via drill 0.3)
  Top 0.127: Q10.2 16.73,58.37 R18.2 15.14,58.04 v14.88,58.29 | F7.1 23.14,33.78 v24.54,35.18 24.28,34.93 v17.17,34.93
  Bottom 0.127: v14.88,58.29 14.88,47.1 15.42,46.56 15.42,36.67 v17.17,34.93
CS8
  Top 0.127: R23.2 Q11.3 24.03,61.34 23.01,62.36 9.66,62.36 8.91,61.61 7.03,61.61 6.5,61.09 3.81,61.09 J$2.10
CS8_3V  (via drill 0.3)
  Top 0.127: Q11.2 23.08,58.37 R19.2 20.21,56.78 v19.46,57.53 | F8.1 29.49,26.16 v29.36,26.04 28.85,26.54 28.85,27.3 27.84,28.32 24.79,28.32 21.74,28.32 21.23,27.81 v19.86,27.81
  Bottom 0.127: v19.86,27.81 21.23,29.18 21.23,40.77 22.5,42.04 22.5,49.66 22.5,55.19 | 22.5,55.19 22.5,55.25 | v19.46,57.53 20.22,56.77 R19.2 22.5,55.75 22.5,55.19
CS9  (via drill 0.4)
  Top 0.127: R24.2 Q12.3 30.38,61.85 29.62,62.61 9.55,62.61 9.04,62.1 v7.28,62.1
  Bottom 0.127: J$2.9 6.71,57.23 7.52,58.04 7.52,61.87 v7.28,62.1
CS9_3V  (via drill 0.3)
  Top 0.127: Q12.2 29.43,58.37 R20.2 26.81,56.78 v26.57,57.02 | F9.1 32.79,33.78 v34.19,35.18 27.33,35.18 v26.82,35.69
  Bottom 0.127: v26.82,35.69 26.82,41.02 27.84,42.04 27.84,48.64 27.08,49.4 27.08,56.52 v26.57,57.02
CS10  (via drill 0.4)
  Top 0.127: R27.2 Q13.3 36.73,62.61 36.46,62.88 8.84,62.88 8.35,63.37 v7.77,63.37
  Bottom 0.127: J$2.8 7.57,53.26 7.77,53.47 v7.77,63.37
CS10_3V  (via drill 0.3)
  Top 0.127: Q13.2 35.78,58.37 R25.2 33.95,57.02 v32.41,57.02 | F10.1 41.43,26.16 v40.03,27.56 39.27,28.32 32.66,28.32 32.16,27.81 v31.65,27.81
  Bottom 0.127: v31.65,27.81 30.19,29.27 30.19,30.08 29.62,30.65 29.62,48.13 30.63,49.15 33.43,49.15 34.19,49.91 34.19,55.75 32.92,57.02 v32.41,57.02
CS11  (via drill 0.4)
  Top 0.127: R28.2 Q14.3 42.82,59.07 42.82,62.36 41.87,63.31 30.4,63.31 30.33,63.37 v9.04,63.37
  Bottom 0.127: J$2.7 6.91,49.3 8.03,50.42 8.03,62.36 v9.04,63.37
CS11_3V  (via drill 0.3)
  Top 0.127: Q14.2 40.54,59.23 R26.2 38.77,56.78 v38.76,56.77 | F11.1 43.21,33.78 v44.35,34.93 39.01,34.93 v38.76,35.18 | v35.71,43.82 39.01,43.82 v39.52,44.32
  Bottom 0.127: v38.76,35.18 38.76,40.77 v35.71,43.82 | v39.52,44.32 39.52,50.93 40.28,51.69 40.28,55.25 v38.76,56.77
CS12  (via drill 0.3)
  Top 0.127: R33.2 Q15.3 49.67,59.05 v51.97,59.05 | J$2.6 47.58,45.34 v48.35,46.1
  Bottom 0.127: v48.35,46.1 48.35,55.43 v51.97,59.05
CS12_3V  (via drill 0.3)
  Top 0.127: Q15.2 48.48,58.37 R29.2 45.35,56.78 v45.11,57.02 | F12.1 51.69,35.15 v51.71,35.18 45.87,35.18 v45.62,35.43
  Bottom 0.127: v45.62,35.43 45.11,35.94 45.11,43.82 43.33,45.59 43.33,55.25 v45.11,57.02
CS13  (via drill 0.3)
  Top 0.127: 55.78,56.89 Q16.3 | 55.78,56.89 R34.2 | v3.2,55.25 5.74,55.25 7.01,53.98 54,53.98 54.51,54.48 54.51,55.62 55.78,56.89
  Bottom 0.127: J$2.5 3.71,42.29 1.93,44.07 1.93,53.98 v3.2,55.25
CS13_3V  (via drill 0.3)
  Top 0.127: Q16.2 54.83,58.37 R30.2 51.7,56.78 v51.46,57.02 | F13.1 65.3,26.16 v65.94,26.8 64.67,28.07 49.43,28.07 48.92,27.56 v48.67,27.56 | v52.73,62.36 v47.14,62.36
  Bottom 0.127: v48.67,27.56 46.44,29.78 46.44,37.7 46.38,37.76 46.38,49.54 46.19,49.73 46.19,50.09 46.38,50.28 46.38,54.48 47.65,55.75 47.65,59.05 47.14,59.56 v47.14,62.36 | v51.46,57.02 52.73,58.29 v52.73,62.36
CS14  (via drill 0.4)
  Top 0.127: R35.2 Q17.3 18.95,52.96 18.44,53.47 v12.34,53.47 | v7.52,48.9 9.8,48.9 v10.57,49.66
  Bottom 0.127: J$2.4 4.93,37.41 5.74,38.23 5.74,47.12 v7.52,48.9 | v10.57,49.66 10.57,51.69 v12.34,53.47
CS14_3V  (via drill 0.3)
  Top 0.127: Q17.2 18,49.48 R31.2 14.39,47.89 v14.38,47.88 14.12,47.88 13.36,47.12 v11.33,47.12 | F14.1 18.06,26.16 v17.93,26.29 16.41,27.81 v14.38,27.81
  Bottom 0.127: v14.38,27.81 11.33,30.86 v11.33,47.12
CS15  (via drill 0.4)
  Top 0.127: 12.6,49.89 Q18.3 | 12.6,49.89 R36.2 | v10.06,52.96 12.09,52.96 12.6,52.45 12.6,49.89
  Bottom 0.127: J$2.3 4.52,33.45 5.99,34.93 5.99,46.36 8.79,49.15 8.79,51.69 v10.06,52.96
CS15_3V  (via drill 0.3)
  Top 0.127: Q18.2 11.65,49.48 R32.2 5.25,47.89 v4.72,47.37 | F15.1 7.9,26.16 v6.25,24.51 | v4.47,39.24 6.25,39.24 v7.52,37.97
  Bottom 0.127: v4.72,47.37 4.72,46.48 5.23,45.97 5.23,40.01 v4.47,39.24 | v7.52,37.97 7.52,25.78 v6.25,24.51
CS16  (via drill 0.4)
  Top 0.127: R41.2 11.33,40.27 Q19.3 11.33,43.56 10.82,44.07 7.52,44.07 7.01,44.58 v6.5,44.58
  Bottom 0.127: J$2.2 3.71,29.84 6.25,32.39 6.25,44.32 v6.5,44.58
CS16_3V  (via drill 0.3)
  Top 0.127: Q19.2 10.38,39.32 R37.2 7.76,39 v7.52,39.24 | F16.1 5.87,18.54 v5.74,18.41
  Bottom 0.127: v5.74,18.41 8.79,21.46 8.79,28.83 9.3,29.34 9.3,37.47 v7.52,39.24
CS17  (via drill 0.4)
  Top 0.127: v7.77,44.83 17.17,44.83 17.68,44.32 Q20.3 17.68,40.27 R42.2
  Bottom 0.127: J$2.1 5.49,25.53 6.5,26.54 6.5,43.56 v7.77,44.83
CS17_3V  (via drill 0.3)
  Top 0.127: Q20.2 16.73,39.32 R38.2 15.38,39 v14.88,39.5 | v15.82,9.53 16.05,9.76 24.91,9.76 F17.1
  Bottom 0.127: v14.88,39.5 12.85,37.47 12.85,30.86 15.82,27.89 v15.82,9.53
CS18  (via drill 0.3)
  Top 0.127: R43.2 Q21.3 25.31,49.91 v27.84,49.91 | v83.72,53.47 78.89,53.47 78.38,53.98 54.72,53.98 54.21,53.47 35.56,53.47 32.97,50.87 32.97,50.11 v33.17,49.91
  Bottom 0.127: J$3.12 87.53,12.32 90.07,14.86 90.07,51.29 88.4,52.96 84.23,52.96 v83.72,53.47 | v33.17,49.91 v27.84,49.91
CS18_3V  (via drill 0.3)
  Top 0.127: Q21.2 24.35,49.48 R39.2 21.22,47.89 v20.98,48.13 20.98,47.88 20.22,47.12 v17.93,47.12 | F18.1 18.57,18.54 v17.42,19.68
  Bottom 0.127: v17.93,47.12 17.93,26.91 18.37,26.47 18.37,20.63 v17.42,19.68
CS19  (via drill 0.3)
  Top 0.127: R44.2 Q22.3 30.62,50.16 31.9,50.16 35.46,53.72 54.11,53.72 54.61,54.23 78.64,54.23 79.15,53.72 v80.92,53.72
  Bottom 0.127: J$3.11 88.54,15.11 89.81,16.38 89.81,51.18 88.52,52.47 88.5,52.45 85.5,52.45 85.24,52.71 81.94,52.71 v80.92,53.72
CS19_3V  (via drill 0.3)
  Top 0.127: Q22.2 29.43,49.48 R40.2 | R40.2 27.32,47.89 v26.57,48.64 | F19.1 29.49,18.54 v29.36,18.41 | v23.77,47.62 24.28,47.12 26.57,47.12 27.34,47.89 R40.2
  Bottom 0.127: v29.36,18.41 26.31,21.46 26.31,41.02 23.71,43.62 23.71,46.59 23.77,46.65 v23.77,47.62
CS20  (via drill 0.3)
  Top 0.127: R49.2 Q23.3 36.74,49.91 v40.28,49.91 | v83.21,38.48 83.21,40.66 81.33,42.55 41.55,42.55 v40.54,43.56
  Bottom 0.127: J$3.10 87.53,19.94 84.48,22.99 84.48,37.21 v83.21,38.48 | v40.54,43.56 40.54,49.66 v40.28,49.91
CS20_3V  (via drill 0.3)
  Top 0.127: Q23.2 35.78,49.48 R45.2 33.16,47.89 v32.66,48.39 | F20.1 36.6,9.65 v36.47,9.78
  Bottom 0.127: v36.47,9.78 32.66,13.59 32.66,45.66 33.16,46.15 33.16,46.56 32.66,47.05 v32.66,48.39
CS21  (via drill 0.3)
  Top 0.127: 43.08,49.82 Q24.3 | 43.08,49.82 R50.2 | v83.97,39.5 83.97,40.26 81.43,42.8 48.67,42.8 v47.9,43.56 | v46.63,49.91 43.17,49.91 43.08,49.82
  Bottom 0.127: J$3.9 87.48,23.04 84.73,25.78 84.73,38.73 v83.97,39.5 | v47.9,43.56 47.9,48.64 v46.63,49.91
CS21_3V  (via drill 0.3)
  Top 0.127: Q24.2 42.13,49.48 R46.2 39.51,47.89 v38.76,48.64 38.76,48.13 37.74,47.12 v35.2,47.12 | F21.1 41.43,18.54 v40.03,19.94
  Bottom 0.127: v40.03,19.94 37.49,22.48 37.49,23.75 35.2,26.04 v35.2,47.12
CS22  (via drill 0.3)
  Top 0.127: R51.2 Q25.3 49.44,49.91 v52.48,49.91 | v84.23,40.77 81.94,43.05 53.75,43.05 v52.98,43.82
  Bottom 0.127: J$3.8 87.53,28.07 84.99,30.61 84.99,40.01 v84.23,40.77 | v52.98,43.82 52.98,49.4 v52.48,49.91
CS22_3V  (via drill 0.3)
  Top 0.127: Q25.2 48.48,49.48 R47.2 45.61,47.89 v45.11,48.39 43.84,47.12 v41.55,47.12 | F22.1 51.69,26.31 v50.44,27.56
  Bottom 0.127: v50.44,27.56 46.89,31.11 46.89,29.96 49.11,27.74 49.11,27.38 48.85,27.12 48.48,27.12 41.55,34.05 v41.55,47.12
CS23  (via drill 0.3)
  Top 0.127: 55.78,49.84 Q26.3 | 55.78,49.84 R52.2 | v84.23,42.29 83.97,42.29 82.96,43.31 60.35,43.31 v59.59,44.07 | v58.83,49.91 55.85,49.91 55.78,49.84
  Bottom 0.127: J$3.7 87.43,30.96 85.24,33.15 85.24,41.28 v84.23,42.29 | v59.59,44.07 59.59,49.15 v58.83,49.91
CS23_3V  (via drill 0.3)
  Top 0.127: Q26.2 54.83,49.48 R48.2 51.96,47.89 v51.46,48.39 | F23.1 51.69,18.69 v50.44,19.94
  Bottom 0.127: v50.44,19.94 51.21,20.7 51.21,37.72 52.48,38.99 52.48,47.37 v51.46,48.39
CS24  (via drill 0.3)
  Top 0.127: 62.13,49.82 R57.2 | 62.13,49.82 Q27.3 | v84.48,43.31 84.23,43.31 83.97,43.56 65.18,43.56 v64.67,44.07 | v65.18,49.91 62.22,49.91 62.13,49.82
  Bottom 0.127: J$3.6 85.5,36.96 85.5,42.29 v84.48,43.31 | v64.67,44.07 64.67,45.09 65.18,45.59 v65.18,49.91
CS24_3V  (via drill 0.3)
  Top 0.127: Q27.2 61.18,49.48 R53.2 58.56,47.89 58.12,48.33 | 58.12,48.33 v58.06,48.39 | F24.1 61.24,18.54 v60.86,18.16 | v54.76,47.12 57.3,47.12 58.12,47.94 58.12,48.33
  Bottom 0.127: v60.86,18.16 54.76,24.26 v54.76,47.12
CS25
  Top 0.127: Q28.3 R58.2 72.56,43.82 77.37,43.82 78.33,44.78 84.68,44.78 85.75,43.71 85.75,42.04 87.53,40.26 J$3.5
CS25_3V  (via drill 0.3)
  Top 0.127: Q28.2 67.53,49.48 R54.2 64.66,47.89 v64.41,48.13 | F25.1 72.42,18.54 v72.29,18.67 | v69.49,37.97 v66.7,37.97
  Bottom 0.127: v72.29,18.67 70.7,20.26 70.7,28.5 70.51,28.69 70.51,30.61 69.49,31.62 v69.49,37.97 | v66.7,37.97 63.91,40.77 62.64,40.77 62.13,41.28 62.13,46.61 63.65,48.13 v64.41,48.13
CS26  (via drill 0.3)
  Top 0.127: 74.83,49.8 Q29.3 | 74.83,49.8 R59.2 | J$3.4 86.97,42.85 84.73,45.09 77.37,45.09 v76.86,44.58 | v77.88,49.66 74.97,49.66 74.83,49.8
  Bottom 0.127: v76.86,44.58 76.86,47.62 77.88,48.64 v77.88,49.66
CS26_3V  (via drill 0.3)
  Top 0.127: Q29.2 73.88,49.48 R55.2 70.75,47.89 v70.51,48.13 | F26.1 50.32,9.65 v50.19,9.78 | v53.24,35.18 54,35.94 69.49,35.94 v70.26,35.18
  Bottom 0.127: v70.51,48.13 70.51,47.37 69.49,46.36 69.49,41.53 70.26,40.77 v70.26,35.18 | v50.19,9.78 50.19,11.3 51.97,13.08 51.97,33.91 v53.24,35.18
CS27
  Top 0.127: R60.2 Q30.3 81.19,49.91 85.5,49.91 87.53,47.88 J$3.3
CS27_3V  (via drill 0.3)
  Top 0.127: Q30.2 80.23,49.48 R56.2 77.36,47.89 v76.86,48.39 | F27.1 63.02,9.65 v62.89,9.78 63.91,10.79 v72.8,10.79
  Bottom 0.127: v76.86,48.39 76.35,48.39 73.81,45.85 73.81,11.81 v72.8,10.79
CS28
  Top 0.127: Q31.3 R62.2 62.14,56.77 63.14,56.77 63.92,55.99 63.92,55.04 64.48,54.48 84.23,54.48 87.53,51.18 J$3.2
CS28_3V  (via drill 0.3)
  Top 0.127: Q31.2 61.18,58.37 R61.2 58.31,56.78 v58.06,57.02 | F28.1 61.85,33.93 v60.6,35.18
  Bottom 0.127: v60.6,35.18 57.56,35.18 56.03,36.7 56.03,55.04 56.81,55.82 56.86,55.82 v58.06,57.02
CS29  (via drill 0.4)
  Top 0.127: 68.48,58.56 Q32.3 | 68.48,58.56 R64.2 | J$3.1 87.53,55.5 85.24,57.79 76.35,57.79 v76.1,57.53 | v71.78,58.04 69,58.04 68.48,58.56
  Bottom 0.127: v76.1,57.53 72.29,57.53 v71.78,58.04
CS29_3V  (via drill 0.3)
  Top 0.127: Q32.2 67.53,58.37 R63.2 | R63.2 64.15,56.78 v63.91,57.02 | F29.1 72.67,26.16 v72.54,26.04 | v73.56,56.01 66.71,56.01 R63.2
  Bottom 0.127: v72.54,26.04 72.54,32.13 73.56,33.15 v73.56,56.01
CS30  (via drill 0.4)
  Top 0.127: v78.64,59.05 75.07,59.05 Q33.3 R66.2
  Bottom 0.127: J$4.12 74.98,72.87 77.11,70.74 77.11,62.87 78.64,61.34 v78.64,59.05
CS30_3V  (via drill 0.3)
  Top 0.127: Q33.2 73.88,58.37 R65.2 71.01,56.78 v70.76,57.02 | F30.1 71.4,33.78 v71.27,33.66
  Bottom 0.127: v70.76,57.02 70.76,56.77 72.29,55.25 72.29,34.67 v71.27,33.66
GND  (via drill 0.4, 0.5)
  Top 0.203: U3.4 17.97,67.73 v17.68,67.44 | U4.4 80.2,60.11 v79.91,59.82 | U1.4 16.2,2.96 v16.15,2.92 | F17.4 22.63,5.84 v22.5,5.97 | F20.4 37.11,5.84 v36.98,5.71 | F27.4 63.78,5.84 v63.65,5.71 | F26.4 50.57,5.84 v50.44,5.71 | F25.4 73.18,14.73 v72.8,14.35 | F1.4 71.65,37.59 v71.53,37.47 | F2.4 57.43,37.59 v57.3,37.47 | F3.4 46,37.59 v45.87,37.47 | F4.4 34.06,37.59 v33.93,37.47 | F5.4 22.12,37.59 v22,37.47 | F6.4 8.66,29.97 v8.53,30.1 | F7.4 19.58,29.97 v19.46,29.84 | F9.4 29.74,29.97 v29.62,29.84 | F11.4 39.65,29.97 v39.52,29.84 | F28.4 59.97,29.97 v59.84,29.84 | F12.4 49.81,29.97 v49.68,29.84 | F30.4 71.4,29.97 v71.27,29.84 | F29.4 72.67,22.35 v72.54,22.22 | F15.4 6.38,22.35 v6.25,22.22 | F16.4 6.12,14.73 v5.99,14.86 | F18.4 17.55,14.73 v17.17,14.35 | F14.4 17.81,22.35 v17.42,21.97 | F8.4 28.98,22.35 v28.6,21.97 | F19.4 29.24,14.73 v28.85,14.35 | F10.4 39.65,22.35 v39.52,22.22 | F21.4 39.65,14.73 v39.52,14.61 | F23.4 49.81,14.73 v49.68,14.61 | F22.4 49.56,22.35 v49.43,22.22 | F13.4 60.99,22.35 v60.86,22.22 | F24.4 61.24,14.73 v60.86,14.35
  Top 0.305: C3.1 v13.36,77.6 | C4.1 v13.61,75.06 | U2.GND 24.54,76.33 v25.04,76.83
  pour Route15 (isolate 0.254): -0.1,0.13 91.34,0.13 91.34,72.52 81.18,72.52 81.18,81.41 10.06,81.41 10.06,71.25 -0.1,71.25
MISO
  Top 0.127: R6.2 67.21,66.94 Q2.3 67.21,70.74 66.45,71.5 53.75,71.5 51.71,73.53 J$1.7
MISO_3V  (via drill 0.3)
  Top 0.127: F5.2 28.1,40.13 28.57,39.66 30.72,39.66 31.14,39.24 33.93,39.24 34.7,40.01 36.32,40.01 F4.2 40.8,40.13 41.51,39.42 47.17,39.42 F3.2 51.84,40.13 52.67,39.3 52.7,39.33 58.51,39.33 F2.2 63.53,40.13 64.33,39.33 v67.43,39.33 72.48,39.33 F1.2 | F6.2 15.27,32.51 16.07,31.71 20.41,31.71 F7.2 25.43,32.51 26.23,31.71 30.57,31.71 F9.2 32.17,31.71 37.82,31.71 37.91,31.62 40.03,31.62 40.92,32.51 F11.2 45.75,32.51 46.55,31.71 50.89,31.71 F12.2 56.04,32.51 56.51,32.04 56.63,32.04 56.96,31.71 61.05,31.71 F28.2 62.65,31.71 v65.17,31.71 68.3,31.71 68.39,31.62 71.02,31.62 71.91,32.51 F30.2 | F17.2 29.24,8.38 30.04,7.58 38.19,7.58 F20.2 43.21,8.38 44.01,7.58 52.16,7.58 F26.2 v55.25,8.38 57.18,8.38 57.98,7.58 64.86,7.58 F27.2 | F15.2 12.73,24.89 13.53,24.09 19.14,24.09 F14.2 v21.94,24.89 23.9,24.89 24.73,24.06 24.76,24.09 30.57,24.09 F8.2 35.59,24.89 36.39,24.09 40.73,24.09 F10.2 45.88,24.89 46.35,24.42 46.47,24.42 46.8,24.09 50.89,24.09 F22.2 55.91,24.89 56.71,24.09 62.32,24.09 F13.2 v66.02,24.89 67.34,24.89 68.14,24.09 73.75,24.09 F29.2 | F16.2 12.73,17.27 13.53,16.47 19.14,16.47 F18.2 v22.24,17.27 24.16,17.27 24.96,16.47 30.57,16.47 F19.2 35.59,17.27 36.39,16.47 40.73,16.47 F21.2 45.49,17.27 46.32,16.44 46.35,16.47 50.89,16.47 F23.2 v54.19,17.27 55.65,17.27 56.48,16.44 56.51,16.47 62.32,16.47 F24.2 67.34,17.27 68.14,16.47 73.75,16.47 F25.2 | Q2.2 66.26,67.26 R2.2 66.43,65.67 v66.45,65.66
  Bottom 0.127: v66.45,65.66 66.45,56.52 66.95,56.01 66.95,47.12 66.19,46.36 66.19,40.57 v67.43,39.33 67.43,26.52 | v66.02,24.89 66.02,25.1 67.43,26.52 | v22.24,17.27 21.94,17.58 v21.94,24.89 | v55.25,8.38 54.19,9.44 v54.19,17.27 | 67.43,26.52 65.17,28.78 v65.17,31.71
MOSI
  Top 0.127: R7.2 73.56,66.94 Q3.3 73.56,70.74 72.54,71.75 57.56,71.75 55.78,73.53 J$1.8
MOSI_3V  (via drill 0.3)
  Top 0.127: F5.5 31.78,37.59 32.66,36.7 41.2,36.7 F4.5 42.44,37.59 43.33,36.7 52.63,36.7 F3.5 53.52,37.44 54.51,36.45 63.8,36.45 F2.5 64.95,37.44 65.68,36.7 v68.81,36.7 78.03,36.7 F1.5 | F6.5 16.69,29.31 17.42,28.57 25.45,28.57 F7.5 26.85,29.57 27.84,28.57 35.61,28.57 F9.5 37.01,29.57 38,28.57 45.77,28.57 F11.5 47.17,29.57 48.16,28.57 55.93,28.57 F12.5 57.33,29.57 58.32,28.57 66.09,28.57 F28.5 67.49,29.57 68.73,28.32 v70.26,28.32 77.27,28.32 F30.5 | F17.5 30.66,5.69 31.39,4.95 43.74,4.95 F20.5 44.63,5.69 45.36,4.95 57.71,4.95 F26.5 58.7,5.84 59.59,4.95 v69.25,4.95 70.41,4.95 F27.5 | F15.5 14.15,21.95 14.63,21.46 17.13,21.46 17.19,21.4 24.63,21.4 F14.5 25.68,22.35 26.57,21.46 28.3,21.46 28.36,21.4 36.06,21.4 F8.5 37.01,22.2 37.74,21.46 46.28,21.46 F10.5 47.52,22.35 48.41,21.46 56.44,21.46 F22.5 57.33,21.95 57.81,21.46 67.87,21.46 F13.5 68.76,22.2 69.49,21.46 v70.17,21.46 79.3,21.46 F29.5 | F16.5 14.15,14.58 15.14,13.59 24.43,13.59 F18.5 25.58,14.58 26.57,13.59 35.86,13.59 F19.5 37.01,14.58 38,13.59 46.02,13.59 F21.5 47.17,14.33 47.9,13.59 56.18,13.59 F23.5 57.33,14.33 58.06,13.59 67.61,13.59 F24.5 69.11,14.73 70.51,13.34 v71.8,13.34 78.79,13.34 F25.5 | Q3.2 72.61,67.26 R3.2 72.53,65.67 v72.8,65.41
  Bottom 0.127: v72.8,65.41 72.8,60.07 71.02,58.29 70.76,58.29 69.75,57.28 69.75,56.01 68.73,54.99 68.73,36.78 v68.81,36.7 68.81,29.77 68.99,29.59 v70.26,28.32 70.26,21.55 v70.17,21.46 70.17,15.4 71.8,13.77 v71.8,13.34 71.8,7.5 v69.25,4.95
N$1
  pour Top (isolate 0.254): -0.1,0.13 91.34,0.13 91.34,72.52 81.18,72.52 81.18,81.41 10.06,81.41 10.06,71.25 -0.1,71.25
N$2
  pour Bottom (isolate 0.254): -0.1,0.13 91.34,0.13 91.34,72.52 81.18,72.52 81.18,81.41 10.06,81.41 10.06,71.25 -0.1,71.25
N$43
  Top 0.127: R67.2 79.06,39.99 F1.7
N$45
  Top 0.127: F4.7 44.21,40.13 R70.2
N$47
  Top 0.127: R68.2 65.09,39.99 F2.7
N$49
  Top 0.127: F5.7 31.51,40.13 R71.2
N$51
  Top 0.127: F3.7 55.64,40.13 R69.2
N$53
  Top 0.127: F6.7 18.81,32.51 R72.2
N$55
  Top 0.127: F7.7 28.97,32.51 R73.2
N$57
  Top 0.127: F10.7 49.29,24.89 R76.2
N$59
  Top 0.127: F8.7 39.13,24.89 R74.2
N$61
  Top 0.127: R77.2 47.31,32.37 F11.7
N$63
  Top 0.127: F9.7 39.13,32.51 R75.2
N$65
  Top 0.127: R78.2 57.47,32.37 F12.7
N$67
  Top 0.127: F13.7 70.88,24.89 R79.2
N$69
  Top 0.127: R82.2 14.29,17.13 F16.7
N$71
  Top 0.127: F14.7 27.7,24.89 R80.2
N$73
  Top 0.127: F17.7 32.78,8.38 R83.2
N$75
  Top 0.127: F15.7 16.27,24.89 R81.2
N$77
  Top 0.127: F18.7 27.7,17.27 R84.2
N$79
  Top 0.127: F19.7 39.13,17.27 R85.2
N$81
  Top 0.127: F22.7 59.45,24.89 R88.2
N$83
  Top 0.127: F20.7 46.75,8.38 R86.2
N$85
  Top 0.127: F23.7 59.45,17.27 R89.2
N$87
  Top 0.127: F21.7 49.29,17.27 R87.2
N$89
  Top 0.127: F24.7 70.88,17.27 R90.2
N$91
  Top 0.127: F25.7 82.31,17.27 R91.2
N$93
  Top 0.127: R94.2 67.63,32.37 F28.7
N$95
  Top 0.127: R92.2 58.74,8.24 F26.7
N$97
  Top 0.127: F29.7 82.31,24.89 R95.2
N$99
  Top 0.127: R93.2 71.44,8.24 F27.7
N$101
  Top 0.127: R96.2 79.06,32.37 F30.7
SCK
  Top 0.127: R5.2 Q1.3 60.86,70.48 60.1,71.25 49.43,71.25 47.14,73.53 J$1.6
SCK_3V  (via drill 0.3)
  Top 0.127: F5.6 34.82,38.86 35.46,38.23 41.45,38.23 F4.6 45.75,38.86 46.38,38.23 52.88,38.23 F3.6 57.94,38.86 58.74,38.06 60.69,38.06 v61.37,38.73 64.82,38.73 F2.6 71.15,38.86 71.78,38.23 78.28,38.23 F1.6 | F30.6 78.28,30.61 72.29,30.61 71.65,31.24 F28.6 66.69,30.44 v63.75,30.44 61.28,30.44 60.48,31.24 F12.6 56.53,30.44 51.12,30.44 50.32,31.24 F11.6 46.37,30.44 40.71,30.44 39.9,31.24 F9.6 36.21,30.44 30.8,30.44 30,31.24 F7.6 26.05,30.44 20.64,30.44 19.84,31.24 F6.6 | F17.6 37.36,7.11 38.17,6.31 43.83,6.31 F20.6 51.33,7.11 52.14,6.31 57.8,6.31 F26.6 64.29,7.11 65.09,6.31 v67.53,6.31 70.5,6.31 F27.6 | F16.6 18.57,16 19.37,15.2 24.78,15.2 F18.6 30,16 30.8,15.2 36.21,15.2 F19.6 40.16,16 40.96,15.2 46.37,15.2 F21.6 50.32,16 51.12,15.2 56.53,15.2 F23.6 61.49,16 62.3,15.2 v65.72,15.2 67.96,15.2 F24.6 72.92,16 73.73,15.2 79.39,15.2 F25.6 | F15.6 18.57,23.62 19.37,22.82 24.78,22.82 F14.6 29.74,23.62 30.55,22.82 36.21,22.82 F8.6 39.9,23.62 40.71,22.82 46.37,22.82 F10.6 50.32,23.62 51.12,22.82 56.6,22.82 57.4,23.62 | 57.4,23.62 F22.6 | 57.4,23.62 61.75,23.62 62.55,22.82 v65.63,22.82 67.96,22.82 F13.6 72.92,23.62 73.73,22.82 79.39,22.82 F29.6 | Q1.2 59.91,67.26 R1.2 58.05,65.67 v57.05,66.67
  Bottom 0.127: v57.05,66.67 57.05,65.15 57.56,64.64 57.56,62.61 59.08,61.09 59.08,50.67 60.1,49.66 60.1,40.01 v61.37,38.73 61.37,32.83 v63.75,30.44 63.75,24.69 v65.63,22.82 65.63,15.29 v65.72,15.2 65.72,8.12 v67.53,6.31
TEMP  (via drill 0.4)
  Top 0.127: J$4.11 71.02,76.83 70,75.82 | 70,75.82 25.3,75.82 v24.79,75.31 | v24.54,71.25 20.88,71.25 U3.1 16.88,69.68 v16.15,68.96 | 70,75.82 72.54,75.82 v73.81,74.55 | v74.57,62.1 81.5,62.1 U4.1 | v15.65,64.39 5.74,64.39 4.98,63.63 2.18,63.63 v1.68,63.12 | v3.2,4.95 18,4.95 U1.1
  Bottom 0.127: v24.79,75.31 24.79,71.5 v24.54,71.25 | v73.81,74.55 73.81,62.87 v74.57,62.1 | v16.15,68.96 16.15,64.9 v15.65,64.39 | v1.68,63.12 1.68,6.48 v3.2,4.95